# Altium project DWM1000 Base.PrjPCB
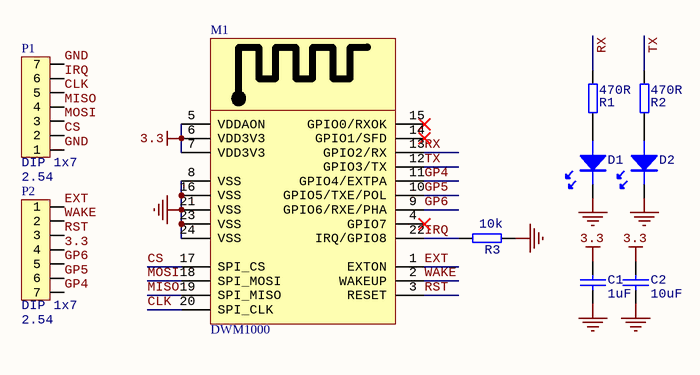
[diagram p0: DWM1000 Base.SchDoc]
1 sheet, 10 parts. Net scope: global (net labels, ports and power ports of the same name join across sheets).
Board file: DWM1000 Base.PcbDoc

## Sheet DWM1000 Base.SchDoc
size Letter

### Parts
C1  1uF  [0603C]
C2  10uF  [0603C]
D1  LED  [LED_0805B]  (value not drawn)
D2  LED  [LED_0805R]  (value not drawn)
M1  DWM1000  [DWM1000]
P1  value 2.54  [HDR1X7_2.54_180]  (hidden comment: DIP 1x7)
P2  value 2.54  [HDR1X7_2.54_180]  (hidden comment: DIP 1x7)
R1  470R  [0603R]
R2  470R  [0603R]
R3  10k  [0603R]

### Nets
3.3: C1.2 C2.2 M1.5(VDDAON) M1.6(VDD3V3) M1.7(VDD3V3) P2.4
GND: C1.1 C2.1 D1.K D2.K M1.8(VSS) M1.16(VSS) M1.21(VSS) M1.23(VSS) M1.24(VSS) P1.1 P1.7 R3.1
CLK: M1.20(SPI_CLK) P1.5
CS: M1.17(SPI_CS) P1.2
EXT: M1.1(EXTON) P2.1
GP4: M1.11(GPIO4/EXTPA) P2.7
GP5: M1.10(GPIO5/TXE/POL) P2.6
GP6: M1.9(GPIO6/RXE/PHA) P2.5
IRQ: M1.22(IRQ/GPIO8) P1.6 R3.2
MISO: M1.19(SPI_MISO) P1.4
MOSI: M1.18(SPI_MOSI) P1.3
RST: M1.3(RESET) P2.3
RX: M1.13(GPIO2/RX) R1.2
TX: M1.12(GPIO3/TX) R2.2
WAKE: M1.2(WAKEUP) P2.2
NetD1_A: D1.A R1.1
NetD2_A: D2.A R2.1

Not connected (* = marked no-connect by the designer): M1 4(GPIO7)* 14(GPIO1/SFD)* 15(GPIO0/RXOK)*

### Notes on the sheet
- Title
- Size:
- Date:
- Letter
- Number:
- Time:
- Revision:
- Sheet
- of
- File:

### Library data of the parts
C1 C2 = CAP
M1 = DWM1000: Module; Manufacturer: Decawave Limited; Frequency: 3.5GHz ~ 6.5GHz; Data Rate: 6.8Mbps; Serial Interfaces: SPI; Antenna Type: Integrated, Chip; Voltage - Supply: 2.8 V ~ 3.6 V; Current - Receiving: 64mA; Current - Transmitting: 31mA; Supplier 1: Digi-Key; Manufacturer Part Number: DWM1000; RoHS: RoHS Compliant; Category: RF/IF and RFID; Stock 1: 1028; Pricing 1: 1=32.16, 10=26.704, 100=24.24, 250=22.51296 (USD); Packaging: Cut Tape (CT); RF Family/Standard: 802.15.4; Protocol: -; Modulation: -; Power - Output: -; Sensitivity: -; Memory Size: -; Mounting Type: Surface Mount; Operating Temperature: -40°C ~ 85°C; Package / Case: Module; ComponentLink1URL: http://www.decawave.com/sites/default/files/product-pdf/dwm1000-product-brief.pdf; ComponentLink1Description: http://www.decawave.com/sites/default/files/product-pdf/dwm1000-product-brief.pdf; Supplier Part Number 1: 1479-1002-1-ND
P1 P2 = 2.54MM_7P: Header; Type: DIP 1x7
R1-R3 = RES